# Altium schematic sheet SAM9X60_Core.SchDoc
size A; DocumentNumber: 2; SheetNumber: 2; SheetTotal: 6
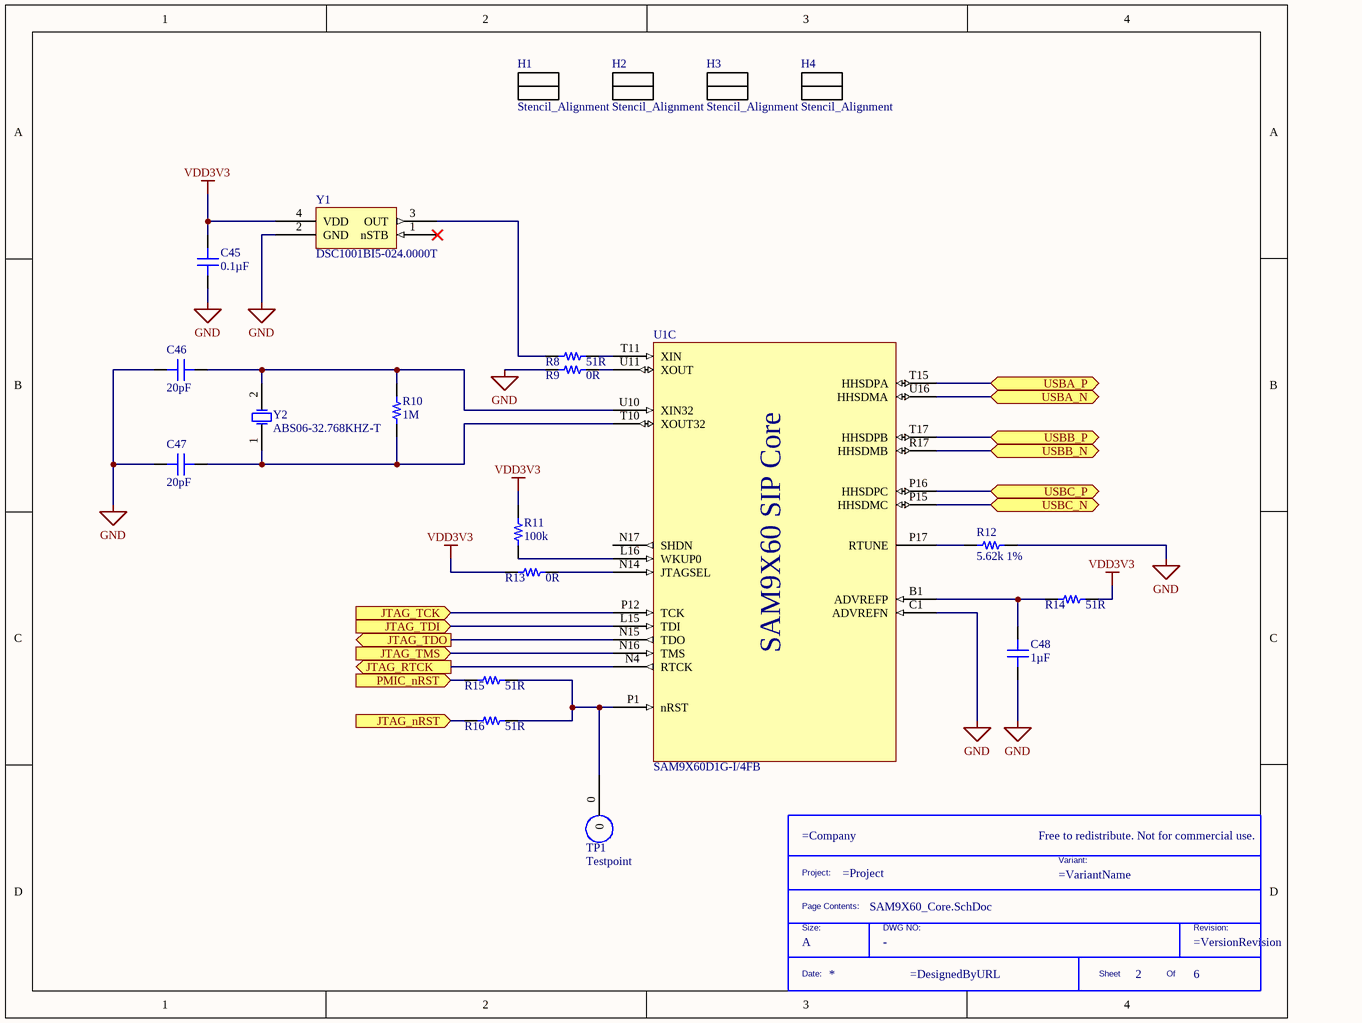
[diagram p0: SAM9X60_Core.SchDoc]

## Parts
*  Size: A  (hidden comment: TitleBlock)  (graphical)
C45  0.1µF  [CAP 0402_1005]
C46  20pF  [CAP 0402_1005]
C47  20pF  [CAP 0402_1005]
C48  1µF  [CAP 0402_1005]
H1  Stencil_Alignment  [Stencil_Alignment]
H2  Stencil_Alignment  [Stencil_Alignment]
H3  Stencil_Alignment  [Stencil_Alignment]
H4  Stencil_Alignment  [Stencil_Alignment]
R8  51R  [RES 0402_1005]
R9  0R  [RES 0402_1005]
R10  1M  [RES 0402_1005]
R11  100k  [RES 0402_1005]
R12  5.62k 1%  [RES 0402_1005]
R13  0R  [RES 0402_1005]
R14  51R  [RES 0402_1005]
R15  51R  [RES 0402_1005]
R16  51R  [RES 0402_1005]
TP1  Testpoint  [Testpoint]  (no BOM)
U1  SAM9X60D1G-I/4FB  [BGA233C80P17X17_1400X1400X120]  (part C of 7)
Y1  DSC1001BI5-024.0000T  [DSC1001BI5]
Y2  ABS06-32.768KHZ-T  [ABRA-ABS06-2_V]

## Ports
JTAG_nRST (in), JTAG_RTCK (out), JTAG_TCK (in), JTAG_TDI (in), JTAG_TDO (out), JTAG_TMS (in), PMIC_nRST (in), USBA_N (bidir), USBA_P (bidir), USBB_N (bidir), USBB_P (bidir), USBC_N (bidir), USBC_P (bidir)

## Nets
GND: C45.2 C46.1 C47.1 C48.1 R9.1 R12.2 U1.C1(ADVREFN) Y1.2(GND)
VDD3V3: C45.1 R11.2 R13.1 R14.2 Y1.4(VDD)
JTAG_nRST: R16.1 ; port JTAG_nRST
JTAG_RTCK: U1.N4(RTCK) ; port JTAG_RTCK
JTAG_TCK: U1.P12(TCK) ; port JTAG_TCK
JTAG_TDI: U1.L15(TDI) ; port JTAG_TDI
JTAG_TDO: U1.N15(TDO) ; port JTAG_TDO
JTAG_TMS: U1.N16(TMS) ; port JTAG_TMS
PMIC_nRST: R15.1 ; port PMIC_nRST
USBA_N: U1.U16(HHSDMA) ; port USBA_N
USBA_P: U1.T15(HHSDPA) ; port USBA_P
USBB_N: U1.R17(HHSDMB) ; port USBB_N
USBB_P: U1.T17(HHSDPB) ; port USBB_P
USBC_N: U1.P15(HHSDMC) ; port USBC_N
USBC_P: U1.P16(HHSDPC) ; port USBC_P
NetC46_2: C46.2 R10.2 U1.U10(XIN32) Y2.2(X2)
NetC47_2: C47.2 R10.1 U1.T10(XOUT32) Y2.1(X1)
NetC48_2: C48.2 R14.1 U1.B1(ADVREFP)
NetR8_1: R8.1 Y1.3(OUT)
NetR8_2: R8.2 U1.T11(XIN)
NetR9_2: R9.2 U1.U11(XOUT)
NetR11_1: R11.1 U1.L16(WKUP0)
NetR12_1: R12.1 U1.P17(RTUNE)
NetR13_2: R13.2 U1.N14(JTAGSEL)
NetR15_2: R15.2 R16.2 TP1.0 U1.P1(nRST)

Not connected (* = marked no-connect by the designer): H1 0; H2 0; H3 0; H4 0; U1 N17(SHDN); Y1 1(nSTB)*

## Notes on the sheet
- (in symbol SAM9X60D1G-I/4FB, part C) SAM9X60 SIP Core
- (in symbol TitleBlock) Free to redistribute. Not for commercial use.; Project:; Variant:; Page Contents:; Size:; DWG NO:; Revision:; Date:; Sheet; Of

## Library data of the parts
* = TitleBlock: Custom Title Block; DWG: -
C45 = C0402C104K4PACTU: CAP CER 0.1UF 16V X5R 0402; Manufacturer: KEMET; Tolerance: ±10%; Part Number: C0402C104K4PACTU; Value: 0.1µF; Applications: General Purpose; Capacitance: 0.1µF; ComponentLink1Description: Datasheet; ComponentLink1URL: https://api.kemet.com/component-edge/download/datasheet/C0402C104K4PACTU.pdf; ComponentLink2Description: DigiKey Link; ComponentLink2URL: http://digikey.com/product-detail/en/kemet/C0402C104K4PACTU/399-7762-1-ND/3471485; Device Package: 0402 (1005 Metric); LastUpdated: 9/2/2020 1:02:03 AM; Lifecycle Status: Active; Minimum Order: 1; Mounting Type: Surface Mount, MLCC; Operating Temperature: -55°C ~ 85°C; Package / Case: 0402 (1005 Metric); Packaging: TapeAndReel; PartId: 11334; Part Status: Active; Price: 0.01; Series: SMD Comm X5R; Size / Dimension: 0.039" L x 0.020" W (1.00mm x 0.50mm); Supplier 1: DigiKey; Supplier Part Number 1: 399-7762-1-ND; Temperature Coefficient: X5R; Thickness (Max): 0.022" (0.55mm); Voltage - Rated: 16V
C46 C47 = GJM1555C1H200FB01D: CAP CER 20PF 50V C0G/NP0 0402; Manufacturer: Murata Electronics; Temperature Coefficient: C0G, NP0; Tolerance: ±1%; Part Number: GJM1555C1H200FB01D; Value: 20pF; Applications: RF, Microwave, High Frequency; Capacitance: 20pF; ComponentLink1Description: Datasheet; ComponentLink1URL: https://search.murata.co.jp/Ceramy/image/img/A01X/G101/ENG/GJM1555C1H200FB01-01.pdf; ComponentLink2Description: DigiKey Link; ComponentLink2URL: http://digikey.com/product-detail/en/murata-electronics/GJM1555C1H200FB01D/490-11204-1-ND/5333044; Device Package: 0402 (1005 Metric); Features: High Q, Low Loss; LastUpdated: 9/2/2020 1:02:17 AM; Lifecycle Status: Active; Minimum Order: 1; Mounting Type: Surface Mount, MLCC; Operating Temperature: -55°C ~ 125°C; Package / Case: 0402 (1005 Metric); Packaging: TapeAndReel; PartId: 4905; Part Status: Active; Price: 0.04; Series: GJM; Size / Dimension: 0.039" L x 0.020" W (1.00mm x 0.50mm); Supplier 1: DigiKey; Supplier Part Number 1: 490-11204-1-ND; Thickness (Max): 0.022" (0.55mm); Voltage - Rated: 50V
C48 = 0402ZD105KAT2A: CAP CER 1UF 10V X5R 0402; Manufacturer: AVX Corporation; Tolerance: ±10%; Part Number: 0402ZD105KAT2A; Value: 1µF; Applications: General Purpose; Capacitance: 1µF; ComponentLink1Description: Datasheet; ComponentLink1URL: http://datasheets.avx.com/cx5r.pdf; ComponentLink2Description: DigiKey Link; ComponentLink2URL: http://digikey.com/product-detail/en/avx-corporation/0402ZD105KAT2A/478-4596-1-ND/1645907; Device Package: 0402 (1005 Metric); LastUpdated: 9/2/2020 1:02:11 AM; Lifecycle Status: Active; Minimum Order: 1; Mounting Type: Surface Mount, MLCC; Operating Temperature: -55°C ~ 85°C; Package / Case: 0402 (1005 Metric); Packaging: TapeAndReel; PartId: 7596; Part Status: Active; Price: 0.03; Series: -; Size / Dimension: 0.039" L x 0.020" W (1.00mm x 0.50mm); Supplier 1: DigiKey; Supplier Part Number 1: 478-4596-1-ND; Temperature Coefficient: X5R; Thickness (Max): 0.022" (0.56mm); Voltage - Rated: 10V
R8 R14-R16 = AC0402FR-0751RL: RES SMD 51 OHM 1% 1/16W 0402; Manufacturer: Yageo; Power (Watts): 0.063W, 1/16W; Resistance: 51 Ohms; Temperature Coefficient: ±100ppm/°C; Part Number: AC0402FR-0751RL; Value: 51R; ComponentLink1Description: Datasheet; ComponentLink1URL: https://www.yageo.com/upload/media/product/productsearch/datasheet/rchip/PYu-AC_51_RoHS_L_7.pdf; ComponentLink2Description: DigiKey Link; ComponentLink2URL: http://digikey.com/product-detail/en/yageo/AC0402FR-0751RL/YAG3500CT-ND/6006349; Composition: Thick Film; Device Package: 0402 (1005 Metric); Features: Automotive AEC-Q200, Moisture Resistant; Height - Seated (Max): 0.015" (0.37mm); LastUpdated: 9/2/2020 1:07:50 AM; Lifecycle Status: Active; Minimum Order: 1; Number of Terminations: 2; Operating Temperature: -55°C ~ 155°C; Package / Case: 0402 (1005 Metric); Packaging: CutTape; PartId: 12070; Part Status: Active; Price: 0.10; Ratings: AEC-Q200; Series: AC; Size / Dimension: 0.039" L x 0.020" W (1.00mm x 0.50mm); Supplier 1: DigiKey; Supplier Part Number 1: YAG3500CT-ND; Supplier Device Package: 0402; Tolerance: ±1%
R9 R13 = CRG0402ZR: RES SMD 0 OHM JUMPER 1/16W 0402; Manufacturer: TE Connectivity Passive Product; Power (Watts): 0.063W, 1/16W; Part Number: CRG0402ZR; ComponentLink1Description: Datasheet; ComponentLink1URL: https://www.te.com/commerce/DocumentDelivery/DDEController?Action=srchrtrv&DocNm=1773204&DocType=DS&DocLang=English; ComponentLink2Description: DigiKey Link; ComponentLink2URL: http://digikey.com/product-detail/en/te-connectivity-passive-product/CRG0402ZR/A106025CT-ND/3477649; Composition: Thick Film; Device Package: 0402 (1005 Metric); Height - Seated (Max): 0.016" (0.40mm); LastUpdated: 9/2/2020 1:07:28 AM; Lifecycle Status: Active; Minimum Order: 1; Number of Terminations: 2; Operating Temperature: -55°C ~ 155°C; Package / Case: 0402 (1005 Metric); Packaging: CutTape; PartId: 20614; Part Status: Active; Price: 0.10; Series: CRG, Neohm; Size / Dimension: 0.039" L x 0.020" W (1.00mm x 0.50mm); Supplier 1: DigiKey; Supplier Part Number 1: A106025CT-ND; Supplier Device Package: 0402; Tolerance: Jumper; Value: 0R
R10 = RCS04021M00JNED: RES SMD 1M OHM 5% 1/5W 0402; Manufacturer: Vishay Dale; Power (Watts): 0.2W, 1/5W; Resistance: 1 MOhms; Temperature Coefficient: ±200ppm/°C; Part Number: RCS04021M00JNED; Value: 1M; ComponentLink1Description: Datasheet; ComponentLink1URL: http://www.vishay.com/docs/20065/rcse3.pdf; ComponentLink2Description: DigiKey Link; ComponentLink2URL: http://digikey.com/product-detail/en/vishay-dale/RCS04021M00JNED/541-2922-1-ND/5867215; Composition: Thick Film; Device Package: 0402 (1005 Metric); Features: Automotive AEC-Q200, Pulse Withstanding; Height - Seated (Max): 0.016" (0.40mm); LastUpdated: 9/2/2020 1:08:03 AM; Lifecycle Status: Active; Minimum Order: 1; Number of Terminations: 2; Operating Temperature: -55°C ~ 155°C; Package / Case: 0402 (1005 Metric); Packaging: TapeAndReel; PartId: 5540; Part Status: Active; Price: 0.01; Ratings: AEC-Q200; Series: RCS e3; Size / Dimension: 0.039" L x 0.020" W (1.00mm x 0.50mm); Supplier 1: DigiKey; Supplier Part Number 1: 541-2922-1-ND; Supplier Device Package: 0402; Tolerance: ±5%
R11 = CRCW0402100KFKEDC: RES SMD 100K OHM 1% 1/16W 0402; Manufacturer: Vishay Dale; Power (Watts): 0.063W, 1/16W; Resistance: 100 kOhms; Temperature Coefficient: ±100ppm/°C; Part Number: CRCW0402100KFKEDC; Value: 100k; ComponentLink1Description: Datasheet; ComponentLink1URL: http://www.vishay.com/docs/28773/crcwce3.pdf; ComponentLink2Description: DigiKey Link; ComponentLink2URL: http://digikey.com/product-detail/en/vishay-dale/CRCW0402100KFKEDC/541-3960-1-ND/7928643; Composition: Thick Film; Device Package: 0402 (1005 Metric); Height - Seated (Max): 0.014" (0.35mm); LastUpdated: 9/2/2020 1:07:49 AM; Lifecycle Status: Active; Minimum Order: 1; Number of Terminations: 2; Operating Temperature: -55°C ~ 155°C; Package / Case: 0402 (1005 Metric); Packaging: CutTape; PartId: 12665; Part Status: Active; Price: 0.10; Series: CRCW-C; Size / Dimension: 0.039" L x 0.020" W (1.00mm x 0.50mm); Supplier 1: DigiKey; Supplier Part Number 1: 541-3960-1-ND; Supplier Device Package: 0402; Tolerance: ±1%
R12 = AC0402FR-075K62L: RES SMD 5.62K OHM 1% 1/16W 0402; Manufacturer: Yageo; Power (Watts): 0.063W, 1/16W; Resistance: 5.62 kOhms; Temperature Coefficient: ±100ppm/°C; Part Number: AC0402FR-075K62L; Value: 5.62k 1%; ComponentLink1Description: Datasheet; ComponentLink1URL: https://www.yageo.com/upload/media/product/productsearch/datasheet/rchip/PYu-AC_51_RoHS_L_7.pdf; ComponentLink2Description: DigiKey Link; ComponentLink2URL: http://digikey.com/product-detail/en/yageo/AC0402FR-075K62L/YAG5303CT-ND/7063646; Composition: Thick Film; Device Package: 0402 (1005 Metric); Features: Automotive AEC-Q200, Moisture Resistant; Height - Seated (Max): 0.015" (0.37mm); LastUpdated: 9/2/2020 1:08:04 AM; Lifecycle Status: Active; Minimum Order: 1; Number of Terminations: 2; Operating Temperature: -55°C ~ 155°C; Package / Case: 0402 (1005 Metric); Packaging: CutTape; PartId: 5233; Part Status: Active; Price: 0.10; Ratings: AEC-Q200; Series: AC; Size / Dimension: 0.039" L x 0.020" W (1.00mm x 0.50mm); Supplier 1: DigiKey; Supplier Part Number 1: YAG5303CT-ND; Supplier Device Package: 0402; Tolerance: ±1%
U1 = SAM9X60D1G-I/4FB: ARM926 MPU, 1GBIT DDR2, BGA, IND TEMP; Manufacturer: Microchip; Manufacturer Part Number: SAM9X60D6K-I/4GB; Supplier 1: Digi-Key; RoHS: No; Category: Microprocessors; Stock 1: 237; Pricing 1: 1=10.63000, 25=9.74040, 100=8.82060 (USD); Supplier Part Number 1: 150-SAM9X60D6K-I/4GB-ND
Y1 = DSC1001BI5-024.0000T: Low-Power Precision CMOS Oscillator 24MHz 1.7V to 3.6V 10ppm 4-Pin Surface Mount T/R; Manufacturer: Microchip; Operating Supply Voltage: 3.3V; Load Capacitance: 15pF; Max Supply Current: 6.3mA; Max Duty Cycle: 55%; Supplier 1: Digi-Key; Manufacturer Part Number: DSC1001BI5-024.0000T; RoHS: Yes; Category: Timers and Oscillators; Pricing 1: 1000=1.95000 (USD); Mount: Surface Mount; Case/Package: SMD/SMT; Min Operating Temperature: -40°C; Max Operating Temperature: 85°C; Frequency: 24MHz; Packaging: Tape and Reel; Package Quantity: 1000; Max Supply Voltage: 3.6V; Min Supply Voltage: 1.7V; Frequency Stability: 10ppm; Termination: Solder; Length: 0.197inch; Width: 0.126inch; Height: 0.035inch; Ratings: AEC-Q100; ComponentLink1URL: http://www.mouser.com/ds/2/268/DSC1001_Datasheet-775857.pdf?src-supplier=Mouser; ComponentLink1Description: http://www.mouser.com/ds/2/268/DSC1001_Datasheet-775857.pdf?src-supplier=Mouser; ComponentLink2URL: http://www.microchip.com/mymicrochip/filehandler.aspx?ddocname=en576698&src-supplier=Digi-Key; ComponentLink2Description: http://www.microchip.com/mymicrochip/filehandler.aspx?ddocname=en576698&src-supplier=Digi-Key; Supplier Part Number 1: DSC1001BI5-024.0000T-ND
Y2 = CMP-2000-05035-1: Low Profile Crystal, 32.768 KHz, -40 to 85 degC, 2-Pin SMD, RoHS, Tape and Reel; Brand: ABRACON; Tolerance: 20PPM; Case Height: 0.6mm; Case Length: 2mm; Case Width: 1.2mm; ESR: 90kOhms; Load Capacitance: 12.5pF; Series: ABS06; Manufacturer URL: http://www.abracon.com/; RoHS: Details; Datasheet URL: http://www.mouser.com/ds/2/3/ABS06-10798.pdf; Package / Case: 2-SMD; Mounting Style: SMD/SMT; Type: LowProfileCrystal; Product Category: Crystals; Datasheet Version: Sep-15; Frequency Stability: 20PPM; Packaging: Reel; Frequency: 32.768kHz; Operating Temperature Range: -40Cto+85C; Package Description: 2-Pin Surface Mounted Device, Body 2 x 1.2 mm, Height 0.6 mm; Dimensions: 1.2mmWx2mmLx0.6mmH; Package Reference: ABS06; Manufacturer: ABRACON; Termination Style: SMD/SMT; Factory Pack Quantity: 3000